# EAGLE schematic ORAO2007 (EAGLE 9.6.2)
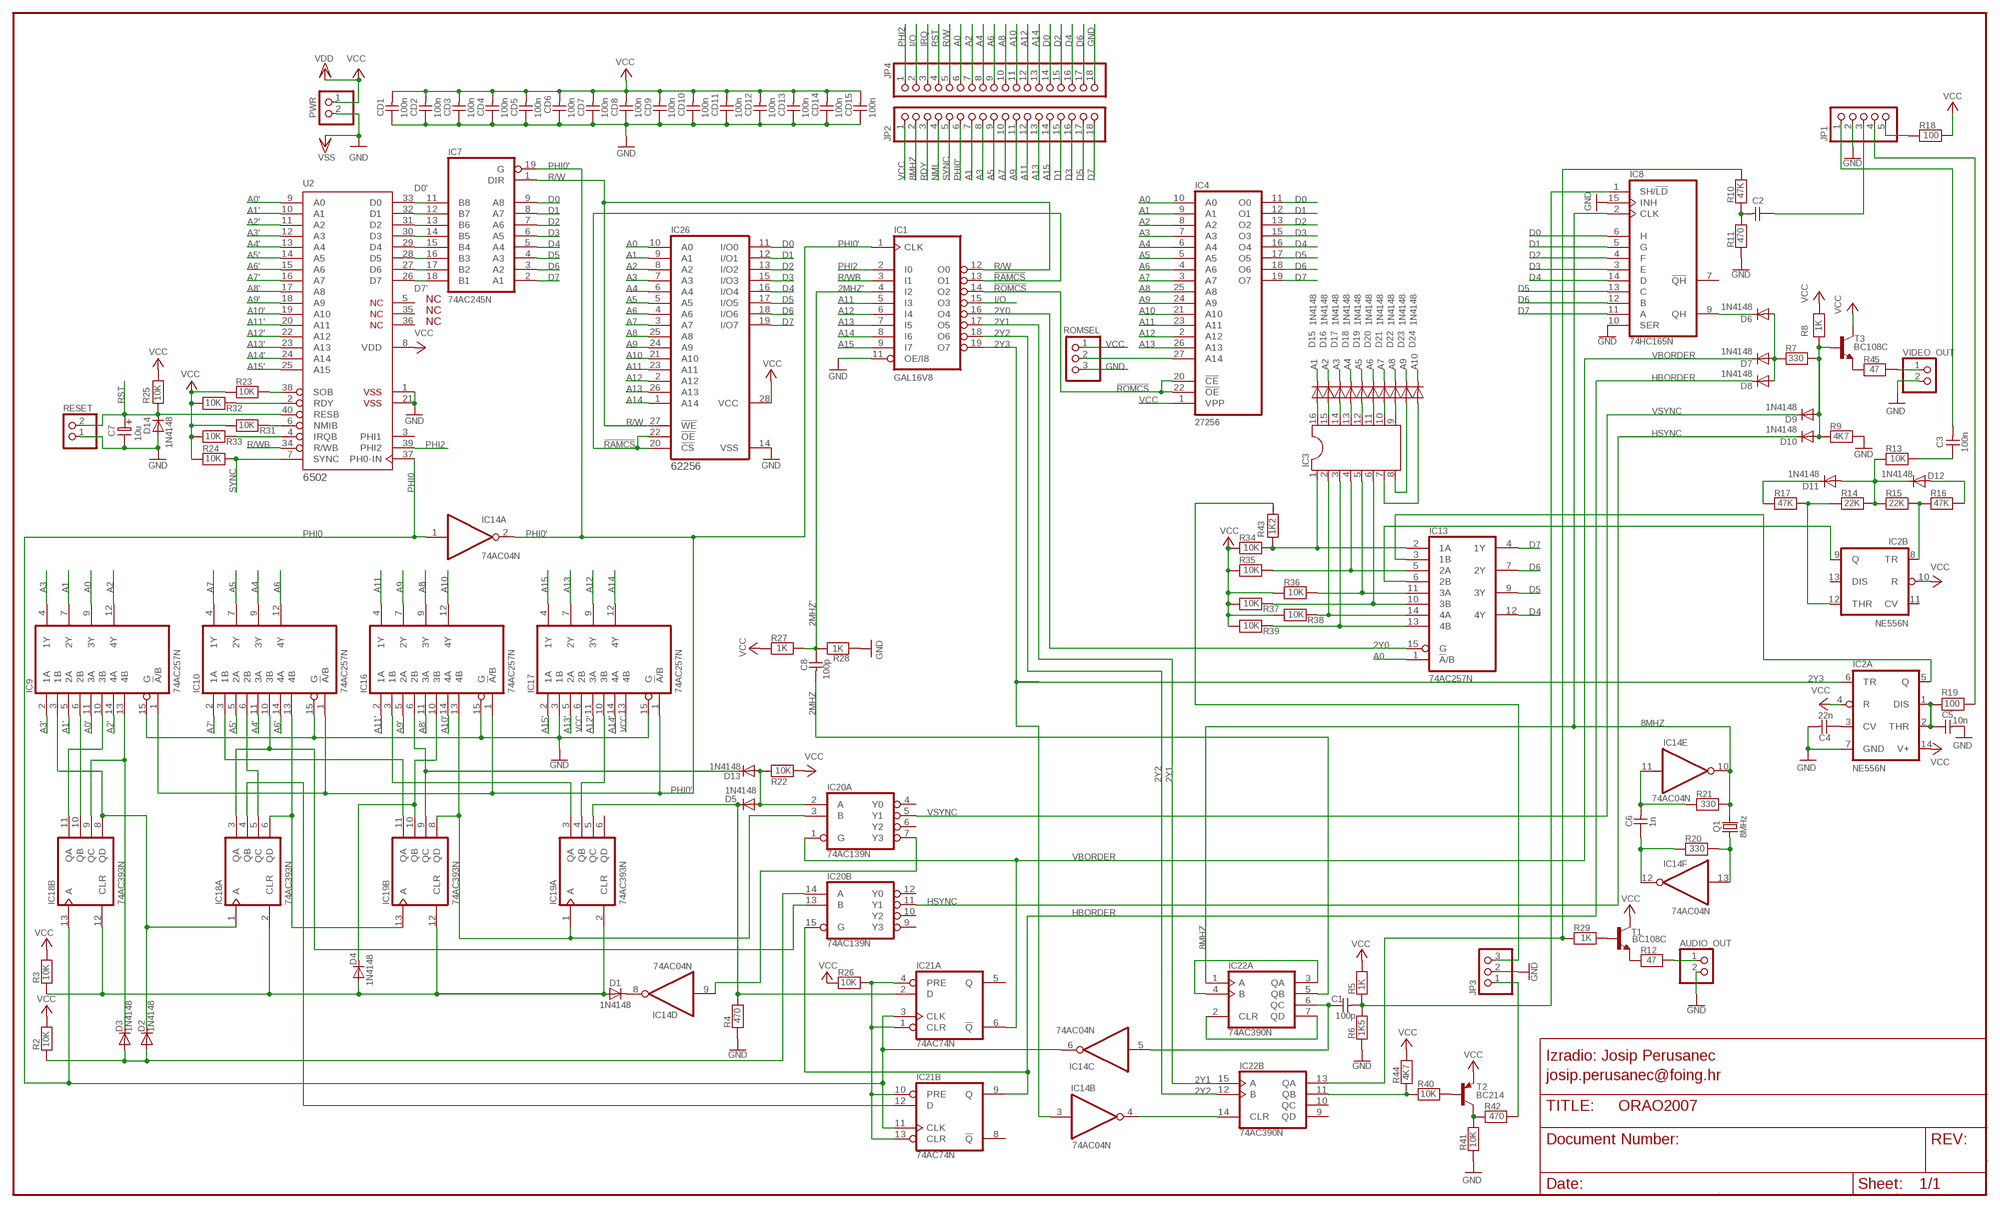
[diagram p0: schematic, sheet 1]

## Parts
AUDIO_OUT  PINHD-1X2  [1X02]
C1  100p  CAPNP-5  [C-5]
C2  CAPNP-5  [C-5]
C3  100n  CAPNP-5  [C-5]
C4  22n  CAPNP-5  [C-5]
C5  10n  CAPNP-5  [C-5]
C6  1n  CAPNP-5  [C-5]
C7  10u  ELC-2,5L  [ES-2,5L]
C8  100p  CAPNP-5  [C-5]
CD1  100n  CAPNP-5  [C-5]
CD2  100n  CAPNP-5  [C-5]
CD3  100n  CAPNP-5  [C-5]
CD4  100n  CAPNP-5  [C-5]
CD5  100n  CAPNP-5  [C-5]
CD6  100n  CAPNP-5  [C-5]
CD7  100n  CAPNP-5  [C-5]
CD8  100n  CAPNP-5  [C-5]
CD9  100n  CAPNP-5  [C-5]
CD10  100n  CAPNP-5  [C-5]
CD11  100n  CAPNP-5  [C-5]
CD12  100n  CAPNP-5  [C-5]
CD13  100n  CAPNP-5  [C-5]
CD14  100n  CAPNP-5  [C-5]
CD15  100n  CAPNP-5  [C-5]
D1  1N4148  [DO35-10]
D2  1N4148  [DO35-10]
D3  1N4148  [DO35-10]
D4  1N4148  [DO35-10]
D5  1N4148  [DO35-10]
D6  1N4148  [DO35-10]
D7  1N4148  [DO35-10]
D8  1N4148  [DO35-10]
D9  1N4148  [DO35-10]
D10  1N4148  [DO35-10]
D11  1N4148  [DO35-10]
D12  1N4148  [DO35-10]
D13  1N4148  [DO35-10]
D14  1N4148  [DO35-10]
D15  1N4148  [DO35-10]
D16  1N4148  [DO35-10]
D17  1N4148  [DO35-10]
D18  1N4148  [DO35-10]
D19  1N4148  [DO35-10]
D20  1N4148  [DO35-10]
D21  1N4148  [DO35-10]
D22  1N4148  [DO35-10]
D23  1N4148  [DO35-10]
D24  1N4148  [DO35-10]
IC1  GAL16V8  16V8  [DIL20]
IC2  NE556N  [DIL14]
IC3  DIL16S  [SOCKED-16]
IC4  27256  [DIL28]
IC7  74AC245N  [DIL20]
IC8  74HC165N  [DIL16]
IC9  74AC257N  [DIL16]
IC10  74AC257N  [DIL16]
IC13  74AC257N  [DIL16]
IC14  74AC04N  [DIL14]
IC16  74AC257N  [DIL16]
IC17  74AC257N  [DIL16]
IC18  74AC393N  [DIL14]
IC19  74AC393N  [DIL14]
IC20  74AC139N  [DIL16]
IC21  74AC74N  [DIL14]
IC22  74AC390N  [DIL16]
IC26  62256  62256P  [DIL28-6]
JP1  PINHD-1X5  [1X05]
JP2  PINHD-1X18  [1X18]
JP3  PINHD-1X3  [1X03]
JP4  PINHD-1X18  [1X18]
PWR  PINHD-1X2  [1X02]
Q1  8MHz  CRYTALHC49S  [HC49/S]
R2  10K  RESEU-7,5  [R-7,5]
R3  10K  RESEU-7,5  [R-7,5]
R4  470  RESEU-7,5  [R-7,5]
R5  1K  RESEU-7,5  [R-7,5]
R6  1K5  RESEU-7,5  [R-7,5]
R7  330  RESEU-7,5  [R-7,5]
R8  1K  RESEU-7,5  [R-7,5]
R9  4K7  RESEU-7,5  [R-7,5]
R10  47K  RESEU-7,5  [R-7,5]
R11  470  RESEU-7,5  [R-7,5]
R12  47  RESEU-7,5  [R-7,5]
R13  10K  RESEU-7,5  [R-7,5]
R14  22K  RESEU-7,5  [R-7,5]
R15  22K  RESEU-7,5  [R-7,5]
R16  47K  RESEU-7,5  [R-7,5]
R17  47K  RESEU-7,5  [R-7,5]
R18  100  RESEU-7,5  [R-7,5]
R19  100  RESEU-7,5  [R-7,5]
R20  330  RESEU-7,5  [R-7,5]
R21  330  RESEU-7,5  [R-7,5]
R22  10K  RESEU-7,5  [R-7,5]
R23  10K  RESEU-7,5  [R-7,5]
R24  10K  RESEU-7,5  [R-7,5]
R25  10K  RESEU-7,5  [R-7,5]
R26  10K  RESEU-7,5  [R-7,5]
R27  1K  RESEU-7,5  [R-7,5]
R28  1K  RESEU-7,5  [R-7,5]
R29  1K  RESEU-7,5  [R-7,5]
R31  10K  RESEU-7,5  [R-7,5]
R32  10K  RESEU-7,5  [R-7,5]
R33  10K  RESEU-7,5  [R-7,5]
R34  10K  RESEU-7,5  [R-7,5]
R35  10K  RESEU-7,5  [R-7,5]
R36  10K  RESEU-7,5  [R-7,5]
R37  10K  RESEU-7,5  [R-7,5]
R38  10K  RESEU-7,5  [R-7,5]
R39  10K  RESEU-7,5  [R-7,5]
R40  10K  RESEU-7,5  [R-7,5]
R41  10K  RESEU-7,5  [R-7,5]
R42  470  RESEU-7,5  [R-7,5]
R43  1K2  RESEU-7,5  [R-7,5]
R44  4K7  RESEU-7,5  [R-7,5]
R45  47  RESEU-7,5  [R-7,5]
RESET  PINHD-1X2  [1X02]
ROMSEL  PINHD-1X3  [1X03]
T1  BC108C  [TO18]
T2  BC214  [TO92]
T3  BC108C  [TO18]
U2  6502  G65SC02P  [DIP-40]
VIDEO_OUT  PINHD-1X2  [1X02]

## Nets
1B9: D2.C IC9.3(1B) IC18.1(A:A) IC18.8(B:QD)
1B10: IC10.3(1B) IC19.11(B:QA)
1B16: IC16.3(1B) IC19.3(A:QA)
2B10: IC10.6(2B) IC18.5(A:QC)
2B16: D13.C IC16.6(2B) IC19.9(B:QC)
2MHZ: C8.2 IC22.5(A:QB)
2MHZ': C8.1 IC1.4(I2) R27.1 R28.2
2Y0: IC1.16(O4) IC13.15(G)
2Y1: IC1.17(O5) IC22.15(B:A)
2Y2: IC1.18(O6) IC22.12(B:B)
2Y3: IC1.19(O7) IC2.6(A:TR) IC14.3(B:I)
3B9: IC9.10(3B) IC18.11(B:QA)
3B10: IC10.10(3B) IC18.3(A:QA) IC20.13(B:B)
3B16: D4.C IC16.10(3B) IC19.10(B:QB)
3B17: IC17.10(3B) IC19.4(A:QB)
4B9: D3.C IC9.13(4B) IC18.9(B:QC)
4B10: IC10.13(4B) IC18.6(A:QD) IC19.13(B:A)
4B16: IC16.13(4B) IC19.1(A:A) IC19.8(B:QD) IC20.3(A:B)
8MHZ: IC8.2(CLK) IC14.10(E:O) IC22.1(A:A) JP2.2 Q1.2 R21.2
!RAMCS: IC1.13(O1) IC26.20(!CS) IC26.22(!OE)
!ROMCS: IC1.14(O2) IC4.20(!CE) IC4.22(!OE)
A0: IC4.10(A0) IC9.9(3Y) IC13.1(!A!/B) IC26.10(A0) JP4.6
A0': IC9.11(3A) U2.9(A0)
A1: D15.C IC4.9(A1) IC9.7(2Y) IC26.9(A1) JP2.7
A1': IC9.5(2A) U2.10(A1)
A2: D16.C IC4.8(A2) IC9.12(4Y) IC26.8(A2) JP4.7
A2': IC9.14(4A) U2.11(A2)
A3: D17.C IC4.7(A3) IC9.4(1Y) IC26.7(A3) JP2.8
A3': IC9.2(1A) U2.12(A3)
A4: D18.C IC4.6(A4) IC10.9(3Y) IC26.6(A4) JP4.8
A4': IC10.11(3A) U2.13(A4)
A5: D19.C IC4.5(A5) IC10.7(2Y) IC26.5(A5) JP2.9
A5': IC10.5(2A) U2.14(A5)
A6: D20.C IC4.4(A6) IC10.12(4Y) IC26.4(A6) JP4.9
A6': IC10.14(4A) U2.15(A6)
A7: D21.C IC4.3(A7) IC10.4(1Y) IC26.3(A7) JP2.10
A7': IC10.2(1A) U2.16(A7)
A8: D22.C IC4.25(A8) IC16.9(3Y) IC26.25(A8) JP4.10
A8': IC16.11(3A) U2.17(A8)
A9: D23.C IC4.24(A9) IC16.7(2Y) IC26.24(A9) JP2.11
A9': IC16.5(2A) U2.18(A9)
A10: D24.C IC4.21(A10) IC16.12(4Y) IC26.21(A10) JP4.11
A10': IC16.14(4A) U2.19(A10)
A11: IC1.5(I3) IC4.23(A11) IC16.4(1Y) IC26.23(A11) JP2.12
A11': IC16.2(1A) U2.20(A11)
A12: IC1.6(I4) IC4.2(A12) IC17.9(3Y) IC26.2(A12) JP4.12
A12': IC17.11(3A) U2.22(A12)
A13: IC1.7(I5) IC4.26(A13) IC17.7(2Y) IC26.26(A13) JP2.13
A13': IC17.5(2A) U2.23(A13)
A14: IC1.8(I6) IC17.12(4Y) IC26.1(A14) JP4.13
A14': IC17.14(4A) U2.24(A14)
A15: IC1.9(I7) IC17.4(1Y) JP2.14
A15': IC17.2(1A) U2.25(A15)
D0: IC4.11(O0) IC7.9(A8) IC8.6(H) IC26.11(I/O0) JP4.14
D0': IC7.11(B8) U2.33(D0)
D1: IC4.12(O1) IC7.8(A7) IC8.5(G) IC26.12(I/O1) JP2.15
D1': IC7.12(B7) U2.32(D1)
D2: IC4.13(O2) IC7.7(A6) IC8.4(F) IC26.13(I/O2) JP4.15
D2': IC7.13(B6) U2.31(D2)
D3: IC4.15(O3) IC7.6(A5) IC8.3(E) IC26.15(I/O3) JP2.16
D3': IC7.14(B5) U2.30(D3)
D4: IC4.16(O4) IC7.5(A4) IC8.14(D) IC13.12(4Y) IC26.16(I/O4) JP4.16
D4': IC7.15(B4) U2.29(D4)
D5: IC4.17(O5) IC7.4(A3) IC8.13(C) IC13.9(3Y) IC26.17(I/O5) JP2.17
D5': IC7.16(B3) U2.28(D5)
D6: IC4.18(O6) IC7.3(A2) IC8.12(B) IC13.7(2Y) IC26.18(I/O6) JP4.17
D6': IC7.17(B2) U2.27(D6)
D7: IC4.19(O7) IC7.2(A1) IC8.11(A) IC13.4(1Y) IC26.19(I/O7) JP2.18
D7': IC7.18(B1) U2.26(D7)
GND [gnd]: AUDIO_OUT.2 C4.2 C5.2 C7.2 CD1.1 CD2.1 CD3.1 CD4.1 CD5.1 CD6.1 CD7.1 CD8.1 CD9.1 CD10.1 CD11.1 CD12.1 CD13.1 CD14.1 CD15.1 D14.A IC1.11(OE/I8) IC2.7(A:GND) IC8.10(SER) IC8.15(INH) IC9.15(G) IC10.15(G) IC16.15(G) IC17.3(1B) IC17.15(G) IC26.14(VSS) JP1.2 JP3.2 JP4.18 PWR.2 R4.1 R6.1 R9.2 R11.1 R28.1 R41.2 RESET.1 ROMSEL.3 U2.1(VSS$1) U2.21(VSS$2) VIDEO_OUT.2 ; supply symbol labelled VSS
HBORDER: D8.C IC20.15(B:G) IC21.9(B:Q)
HSYNC: D10.C IC20.11(B:Y1)
I/O: IC1.15(O3) JP4.2
IRQ: JP4.3 R33.2 U2.4(IRQB)
N$1: R45.1 T3.1(E)
N$2: D15.A IC3.16
N$3: IC4.27(A14) ROMSEL.2
N$4: R45.2 VIDEO_OUT.1
N$5: D1.C IC14.8(D:O)
N$7: IC14.9(D:I) IC20.7(A:Y3)
N$8: D2.A D3.A IC20.14(B:A) R2.2
N$9: D1.A D4.A IC18.2(A:CLR) IC18.12(B:CLR) IC19.2(A:CLR) IC19.12(B:CLR) R3.2
N$14: C2.1 JP1.3
N$15: D5.C IC19.5(A:QC) IC21.2(A:D) R4.2
N$17: IC18.4(A:QB) IC21.12(B:D)
N$18: D5.A D13.A IC20.2(A:A) R22.1
N$20: C1.1 IC14.5(C:I) IC22.6(A:QC)
N$21: C1.2 IC8.1(SH/!LD) R5.1 R6.2
N$22: IC21.1(A:CLR) IC21.4(A:PRE) IC21.10(B:PRE) IC21.13(B:CLR) R26.2
N$23: D6.C IC8.9(QH)
N$24: D6.A D7.A D8.A R7.1
N$26: D9.A D10.A R7.2 R8.1 R9.1 T3.2(B)
N$27: D11.A D12.C R13.2 R14.2 R15.1
N$28: C2.2 R10.2 R11.2
N$29: IC22.13(B:QA) R10.1 R29.2
N$30: R29.1 T1.2(B)
N$31: R12.1 T1.1(E)
N$32: AUDIO_OUT.1 R12.2
N$33: JP1.5 R18.2
N$34: C3.1 R13.1
N$37: D16.A IC3.15
N$38: C3.2 JP1.1
N$39: IC2.8(B:TR) R15.2 R16.1
N$40: D12.A R16.2
N$41: IC2.12(B:THR) R14.1 R17.2
N$42: D11.C R17.1
N$43: IC2.9(B:Q) IC13.6(2B)
N$44: JP3.1 R42.1
N$46: IC2.5(A:Q) IC13.3(1B)
N$47: C4.1 IC2.3(A:CV)
N$48: C5.1 IC2.1(A:DIS) IC2.2(A:THR) R19.1
N$49: JP1.4 R19.2
N$50: IC14.13(F:I) Q1.1 R20.2
N$51: IC14.4(B:O) IC22.14(B:CLR)
N$52: C6.2 IC14.11(E:I) R21.1
N$53: C6.1 IC14.12(F:O) R20.1
N$54: R23.2 U2.38(SOB)
N$55: D17.A IC3.14
N$56: D18.A IC3.13
N$62: IC9.6(2B) IC18.10(B:QB)
N$64: D19.A IC3.12
N$70: IC3.5 IC13.11(3A) R36.2
N$71: IC3.2 IC13.14(4A) R38.2
N$72: IC3.6 IC13.10(3B) R37.2
N$73: IC3.4 IC13.5(2A) R35.2
N$74: IC3.1 IC13.2(1A) R34.2 R43.1
N$75: IC3.3 IC13.13(4B) R39.2
N$76: IC22.2(A:CLR) IC22.7(A:QD)
N$77: IC22.3(A:QA) IC22.4(A:B)
N$78: IC22.11(B:QB) R40.1 R44.1
N$79: R40.2 T2.2(B)
N$80: R41.1 R42.2 T2.3(C)
N$81: JP3.3 R43.2
N$82: D20.A IC3.11
N$83: D21.A IC3.10
N$84: D22.A IC3.9
N$85: D23.A IC3.8
N$86: D24.A IC3.7
NMI: JP2.4 R31.2 U2.6(NMIB)
PHI0: IC14.1(A:I) IC14.6(C:O) IC18.13(B:A) IC21.3(A:CLK) IC21.11(B:CLK) U2.37(PH0-IN)
PHI0': IC1.1(CLK) IC7.19(G) IC9.1(!A!/B) IC10.1(!A!/B) IC14.2(A:O) IC16.1(!A!/B) IC17.1(!A!/B) JP2.6
PHI2: IC1.2(I0) JP4.1 U2.39(PHI2)
R/W: IC1.12(O0) IC7.1(DIR) IC26.27(!WE) JP4.5
R/WB: IC1.3(I1) U2.34(R/WB)
RDY: JP2.3 R32.2 U2.2(RDY)
RST: C7.1 D14.C JP4.4 R25.1 RESET.2 U2.40(RESB)
SYNC: JP2.5 R24.2 U2.7(SYNC)
VBORDER: D7.C IC20.1(A:G) IC21.6(A:!Q)
VCC [vcc]: CD1.2 CD2.2 CD3.2 CD4.2 CD5.2 CD6.2 CD7.2 CD8.2 CD9.2 CD10.2 CD11.2 CD12.2 CD13.2 CD14.2 CD15.2 IC2.4(A:R) IC2.10(B:R) IC2.14(A:V+) IC4.1(VPP) IC17.6(2B) IC17.13(4B) IC26.28(VCC) JP2.1 PWR.1 R2.1 R3.1 R5.2 R8.2 R18.1 R22.2 R23.1 R24.1 R25.2 R26.1 R27.2 R31.1 R32.1 R33.1 R34.1 R35.1 R36.1 R37.1 R38.1 R39.1 R44.2 ROMSEL.1 T1.3(C) T2.1(E) T3.3(C) U2.8(VDD) ; supply symbol labelled VDD
VSYNC: D9.C IC20.5(A:Y1)
Unconnected: IC2.11(B:CV) IC2.13(B:DIS) IC8.7(!QH) IC19.6(A:QD) IC20.4(A:Y0) IC20.6(A:Y2) IC20.9(B:Y3) IC20.10(B:Y2) IC20.12(B:Y0) IC21.5(A:Q) IC21.8(B:!Q) IC22.9(B:QD) IC22.10(B:QC) U2.3(PHI1) U2.5(NC$1) U2.35(NC$2) U2.36(NC$3)

## Notes on the sheet
- Izradio: Josip Perusanec
- josip.perusanec@foing.hr

## Power pins joined to a net without a drawn wire
GND: IC1.10(GND) IC4.14(GND) IC7.10(GND) IC8.8(GND) IC9.8(GND) IC10.8(GND) IC13.8(GND) IC14.7(P:GND) IC16.8(GND) IC17.8(GND) IC18.7(P:GND) IC19.7(P:GND) IC20.8(P:GND) IC21.7(P:GND) IC22.8(P:GND)
VCC: IC1.20(VCC) IC4.28(VCC) IC7.20(VCC) IC8.16(VCC) IC9.16(VCC) IC10.16(VCC) IC13.16(VCC) IC14.14(P:VCC) IC16.16(VCC) IC17.16(VCC) IC18.14(P:VCC) IC19.14(P:VCC) IC20.16(P:VCC) IC21.14(P:VCC) IC22.16(P:VCC)

## Library data of the parts
AUDIO_OUT PWR RESET VIDEO_OUT = pinhead:PINHD-1X2: PIN HEADER
C1-C6 C8 CD1-CD15 = discrete:CAPNP-5
C7 = discrete:ELC-2,5L
D1-D24 = diode:1N4148: DIODE high speed (Philips)
IC1 = pal:16V8: PAL
IC2 = linear:*556: Dual TIMER
IC3 = ic-package:DIL16: Dual In Line
IC4 = memory:27256: MEMORY
IC7 = 74xx-eu:74*245: Octal BUS TRANSCEIVER, 3-state
IC8 = 74xx-eu:74*165: 8-bit parallel load SHIFT REGISTER
IC9 IC10 IC13 IC16 IC17 = 74xx-eu:74*257: Quadruple 2-to 1 line data SELECTOR/MULTIPLEXER
IC14 = 74xx-eu:74*04: Hex INVERTER
IC18 IC19 = 74xx-eu:74*393: Dual 4-bit decade and binary COUNTER
IC20 = 74xx-eu:74*139: Dual 2-line to 4-line DECODER/DEMULTIPLEXER
IC21 = 74xx-eu:74*74: Dual D type positive edge triggered FLIP FLOP, preset and clear
IC22 = 74xx-eu:74*390: Dual 4-bit decade and binary COUNTER
IC26 = memory-hitachi:62256P: MEMORY
JP1 = pinhead:PINHD-1X5: PIN HEADER
JP2 JP4 = pinhead:PINHD-1X18: PIN HEADER
JP3 ROMSEL = pinhead:PINHD-1X3: PIN HEADER
Q1 = crystal:CRYTAL: CRYSTAL
R2-R29 R31-R45 = discrete:RESEU-7,5
T1 T3 = transistor-npn:BC108C: NPN Transistor
T2 = transistor-pnp:BC214: PNP Transistor
U2 = 65xxx:G65SC02P: California Micro Devices Version

## Net classes
0 default: width 0.406 mm, clearance 0.203 mm
1 gnd: width 0.813 mm, clearance 0.203 mm
2 vcc: width 0.813 mm, clearance 0.203 mm